# Altium project doan.PrjPcb
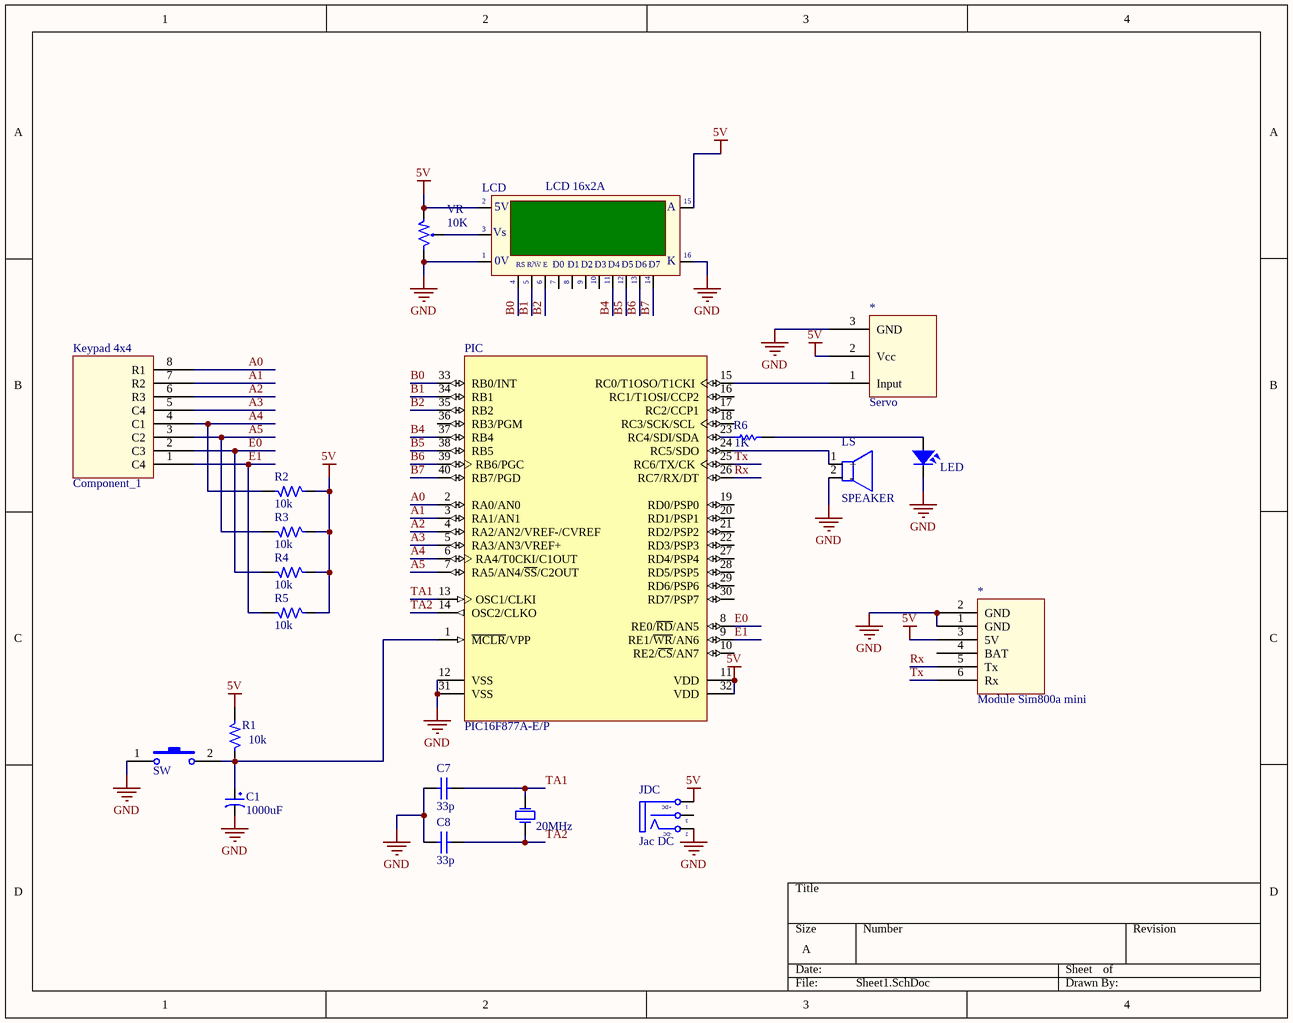
[diagram p0: Sheet1.SchDoc]
1 sheet, 20 parts. Net scope: global (net labels, ports and power ports of the same name join across sheets).
Board file: PCB1.PcbDoc

## Sheet Sheet1.SchDoc
size A

### Parts
(Parts that share a designator on the sheet are numbered #1, #2 ... from top to bottom, then left to right.)
*#1  Servo  [CON3-2]
*#2  Module Sim800a mini  [CON6]
C1  1000uF  [Cap 10mm]
C7  value 33p  [Tu-ceramic]  (hidden comment: Capacitor Ceramic)
C8  value 33p  [Tu-ceramic]  (hidden comment: Capacitor Ceramic)
Crystal  20MHz  [XTAL]
JDC  Jac DC  [DC-IN]
Keypad_4x4  Component_1  [CON8]
LCD  LCD 16x2A  [LCD16X2N]
LED  LED  [LED-5mm BLUE]  (value not drawn)
LS  SPEAKER  [speaker]
PIC  PIC16F877A-E/P  [DIP.100/40/W.600/L2.100]
R1  10k  [R1/4W]
R2  10k  [R1/4W]
R3  10k  [R1/4W]
R4  10k  [R1/4W]
R5  10k  [R1/4W]
R6  value 1K  [Res 10mm (1/2W)]  (hidden comment: RESISTOR)
SW  SW-2P-S  [SW-BIG]  (value not drawn)
VR  10K  [VR_3362P]

### Nets
5V: *#1.2(Vcc) *#2.3(5V) JDC.1(T) LCD.2(VDD) LCD.15(A) PIC.11(VDD) PIC.32(VDD) R1.2 R2.1 R3.1 R4.1 R5.1 VR.3
GND: *#1.3(GND) *#2.1(GND) *#2.2(GND) C1.2 C7.1 C8.1 JDC.2(TN) LCD.1(GND) LCD.16(K) LED.2 LS.2(-) PIC.12(VSS) PIC.31(VSS) SW.1 VR.1
A0: Keypad_4x4.8(R1) PIC.2(RA0/AN0)
A1: Keypad_4x4.7(R2) PIC.3(RA1/AN1)
A2: Keypad_4x4.6(R3) PIC.4(RA2/AN2/VREF-/CVREF)
A3: Keypad_4x4.5(C4) PIC.5(RA3/AN3/VREF+)
A4: Keypad_4x4.4(C1) PIC.6(RA4/T0CKI/C1OUT) R2.2
A5: Keypad_4x4.3(C2) PIC.7(RA5/AN4/~{SS}/C2OUT) R3.2
B0: LCD.4(RS) PIC.33(RB0/INT)
B1: LCD.5(R/~{W}) PIC.34(RB1)
B2: LCD.6(~{EN}) PIC.35(RB2)
B4: LCD.11(D4) PIC.37(RB4)
B5: LCD.12(D5) PIC.38(RB5)
B6: LCD.13(D6) PIC.39(RB6/PGC)
B7: LCD.14(D7) PIC.40(RB7/PGD)
E0: Keypad_4x4.2(C3) PIC.8(RE0/~{RD}/AN5) R4.2
E1: Keypad_4x4.1(C4) PIC.9(RE1/~{WR}/AN6) R5.2
Rx: *#2.5(Tx) PIC.26(RC7/RX/DT)
TA1: C7.2 Crystal.2(OSC2) PIC.13(OSC1/CLKI)
TA2: C8.2 Crystal.1(OSC1) PIC.14(OSC2/CLKO)
Tx: *#2.6(Rx) PIC.25(RC6/TX/CK)
Net*#1_1: *#1.1(Input) PIC.15(RC0/T1OSO/T1CKI)
NetC1_1: C1.1 PIC.1(~{MCLR}/VPP) R1.1 SW.2
NetLCD_3: LCD.3(VEE) VR.2
NetLED_1: LED.1 R6.2
NetLS_1: LS.1(+) PIC.24(RC5/SDO)
NetPIC_23: PIC.23(RC4/SDI/SDA) R6.1

Not connected (* = marked no-connect by the designer): *#2 4(BAT); JDC 3(S); LCD 7(D0) 8(D1) 9(D2) 10(D3); PIC 10(RE2/~{CS}/AN7) 16(RC1/T1OSI/CCP2) 17(RC2/CCP1) 18(RC3/SCK/SCL) 19(RD0/PSP0) 20(RD1/PSP1) 21(RD2/PSP2) 22(RD3/PSP3) 27(RD4/PSP4) 28(RD5/PSP5) 29(RD6/PSP6) 30(RD7/PSP7) 36(RB3/PGM)

### Notes on the sheet
- (in symbol DCIN) +DC; -DC
- (in symbol LCD16x2A) 5V; Vs; |; 0V; R/W; E

### Library data of the parts
C1 = CP1: Cap P  0,1uF < 22uF , 16 - 50V; Value: 10uF/50V; Description 1: 10 => 220uF/6,3V/10V - 10uF => 100uF/16V; Description 2: 0,1uF => 33uF/50V - 10uF => 22uF/63V; Description 3: 0,47uF => 10uF/100V
C7 C8 = CapDecop: Capacitor; Published: 8-Jun-2000; LatestRevisionDate: 17-Jul-2002; LatestRevisionNote: Re-released for DXP Platform.; PackageReference: RAD-0.3; Publisher: Altium Limited
Crystal = XTAL: Crystal Oscillator; Published: 8-Jun-2000; LatestRevisionDate: 17-Jul-2002; LatestRevisionNote: Re-released for DXP Platform.; PackageReference: R38; Publisher: Altium Limited
JDC = DCIN: Jac DC input; Value: Jac DC
LCD = LCD16x2A: LCD dipslay 16 char, 2 line; Value: LCD16x2A
LS = SPEAKER: Vendor: Digikey; Published: 13-April-2009; Publisher: Hoang Nguyen; ComponentLink1Description: Digikey Part Link; ComponentLink2Description: Open Datasheet; ComponentLink2URL: H:\LIBRARY\LIBRARY.Datasheet\
PIC = PIC16F877A-E/P: Enhanced FLASH Microcontroller, 8K (x14-Bit words) FLASH, 368 Bytes RAM, 40-Pin PDIP, Standard VDD Range, Extended Temperature; PackageDocument: 2003; Note: 25mA sink/source per I/O.; Published: 11-Oct-2004; LatestRevisionDate: 4-Mar-2005; LatestRevisionNote: Stylized 3D Model Added.; DatasheetDocument: DS39582B_2003; PackageReference: PDIP600-40; Publisher: Altium Limited; Code_JEDEC: MO-011; ComponentLink1Description: Manufacturer Link; ComponentLink1URL: http://www.microchip.com/index.asp; ComponentLink2Description: Datasheet; ComponentLink2URL: http://ww1.microchip.com/downloads/en/DeviceDoc/39582b.pdf; ComponentLink3Description: Packaging Specification; ComponentLink3URL: http://ww1.microchip.com/downloads/en/PackagingSpec/00049AD.pdf
R1-R5 = R: Resistor 1/4W; Value: R1/4W - 1K
SW = SW-2PIN-SMALL: Switch Small 2 Pin; Published: 24-Mar-1999; LatestRevisionDate: 17-Jul-2002; LatestRevisionNote: Re-released for DXP Platform.; PackageReference: SPST-2; Publisher: Altium Limited
VR = VR1: Var Resistor; Value: VR 10K
R6 = RESISTOR: Published: 8-Jun-2000; LatestRevisionDate: 17-Jul-2002; LatestRevisionNote: Re-released for DXP Platform.; PackageReference: AXIAL-0.3; Publisher: Altium Limited